# Altium project Tigresse_experience.PrjPcb
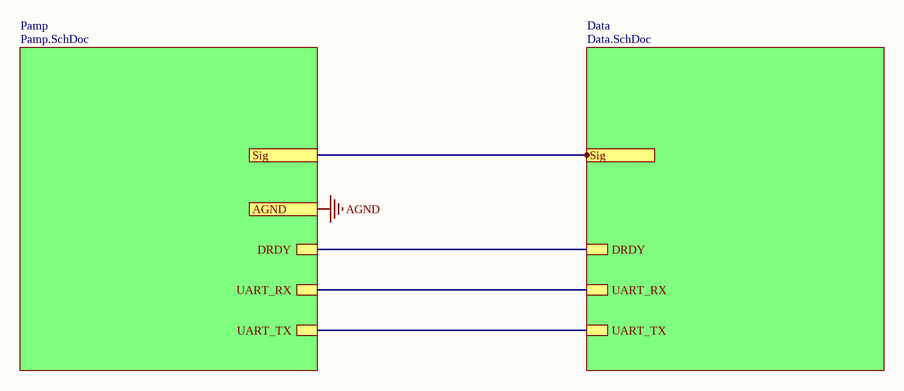
[diagram p0: schumann_exp.SchDoc]
3 sheets, 47 parts. Net scope: hierarchical (ports join the sheet entries above them; power ports are global).
Board file: pcb_tigresse_experiment.PcbDoc
Sheets:
  schumann_exp.SchDoc
    Pamp = Pamp.SchDoc
    Data = Data.SchDoc

## Sheet schumann_exp.SchDoc
size A3; SheetNumber: 1; SheetTotal: 3

### Sub-sheets
Data = Data.SchDoc: Sig, UART_TX, UART_RX, DRDY
Pamp = Pamp.SchDoc: UART_RX, UART_TX, DRDY

### Ports
AGND, Sig

### Nets
NetADC_14: sheet Pamp/DRDY, sheet Data/DRDY
NetADC_15: sheet Pamp/UART_RX, sheet Data/UART_RX
NetADC_16: sheet Pamp/UART_TX, sheet Data/UART_TX
(unnamed): port Sig, sheet Data/Sig

## Sheet Pamp.SchDoc
size A3; SheetNumber: 2; SheetTotal: 3
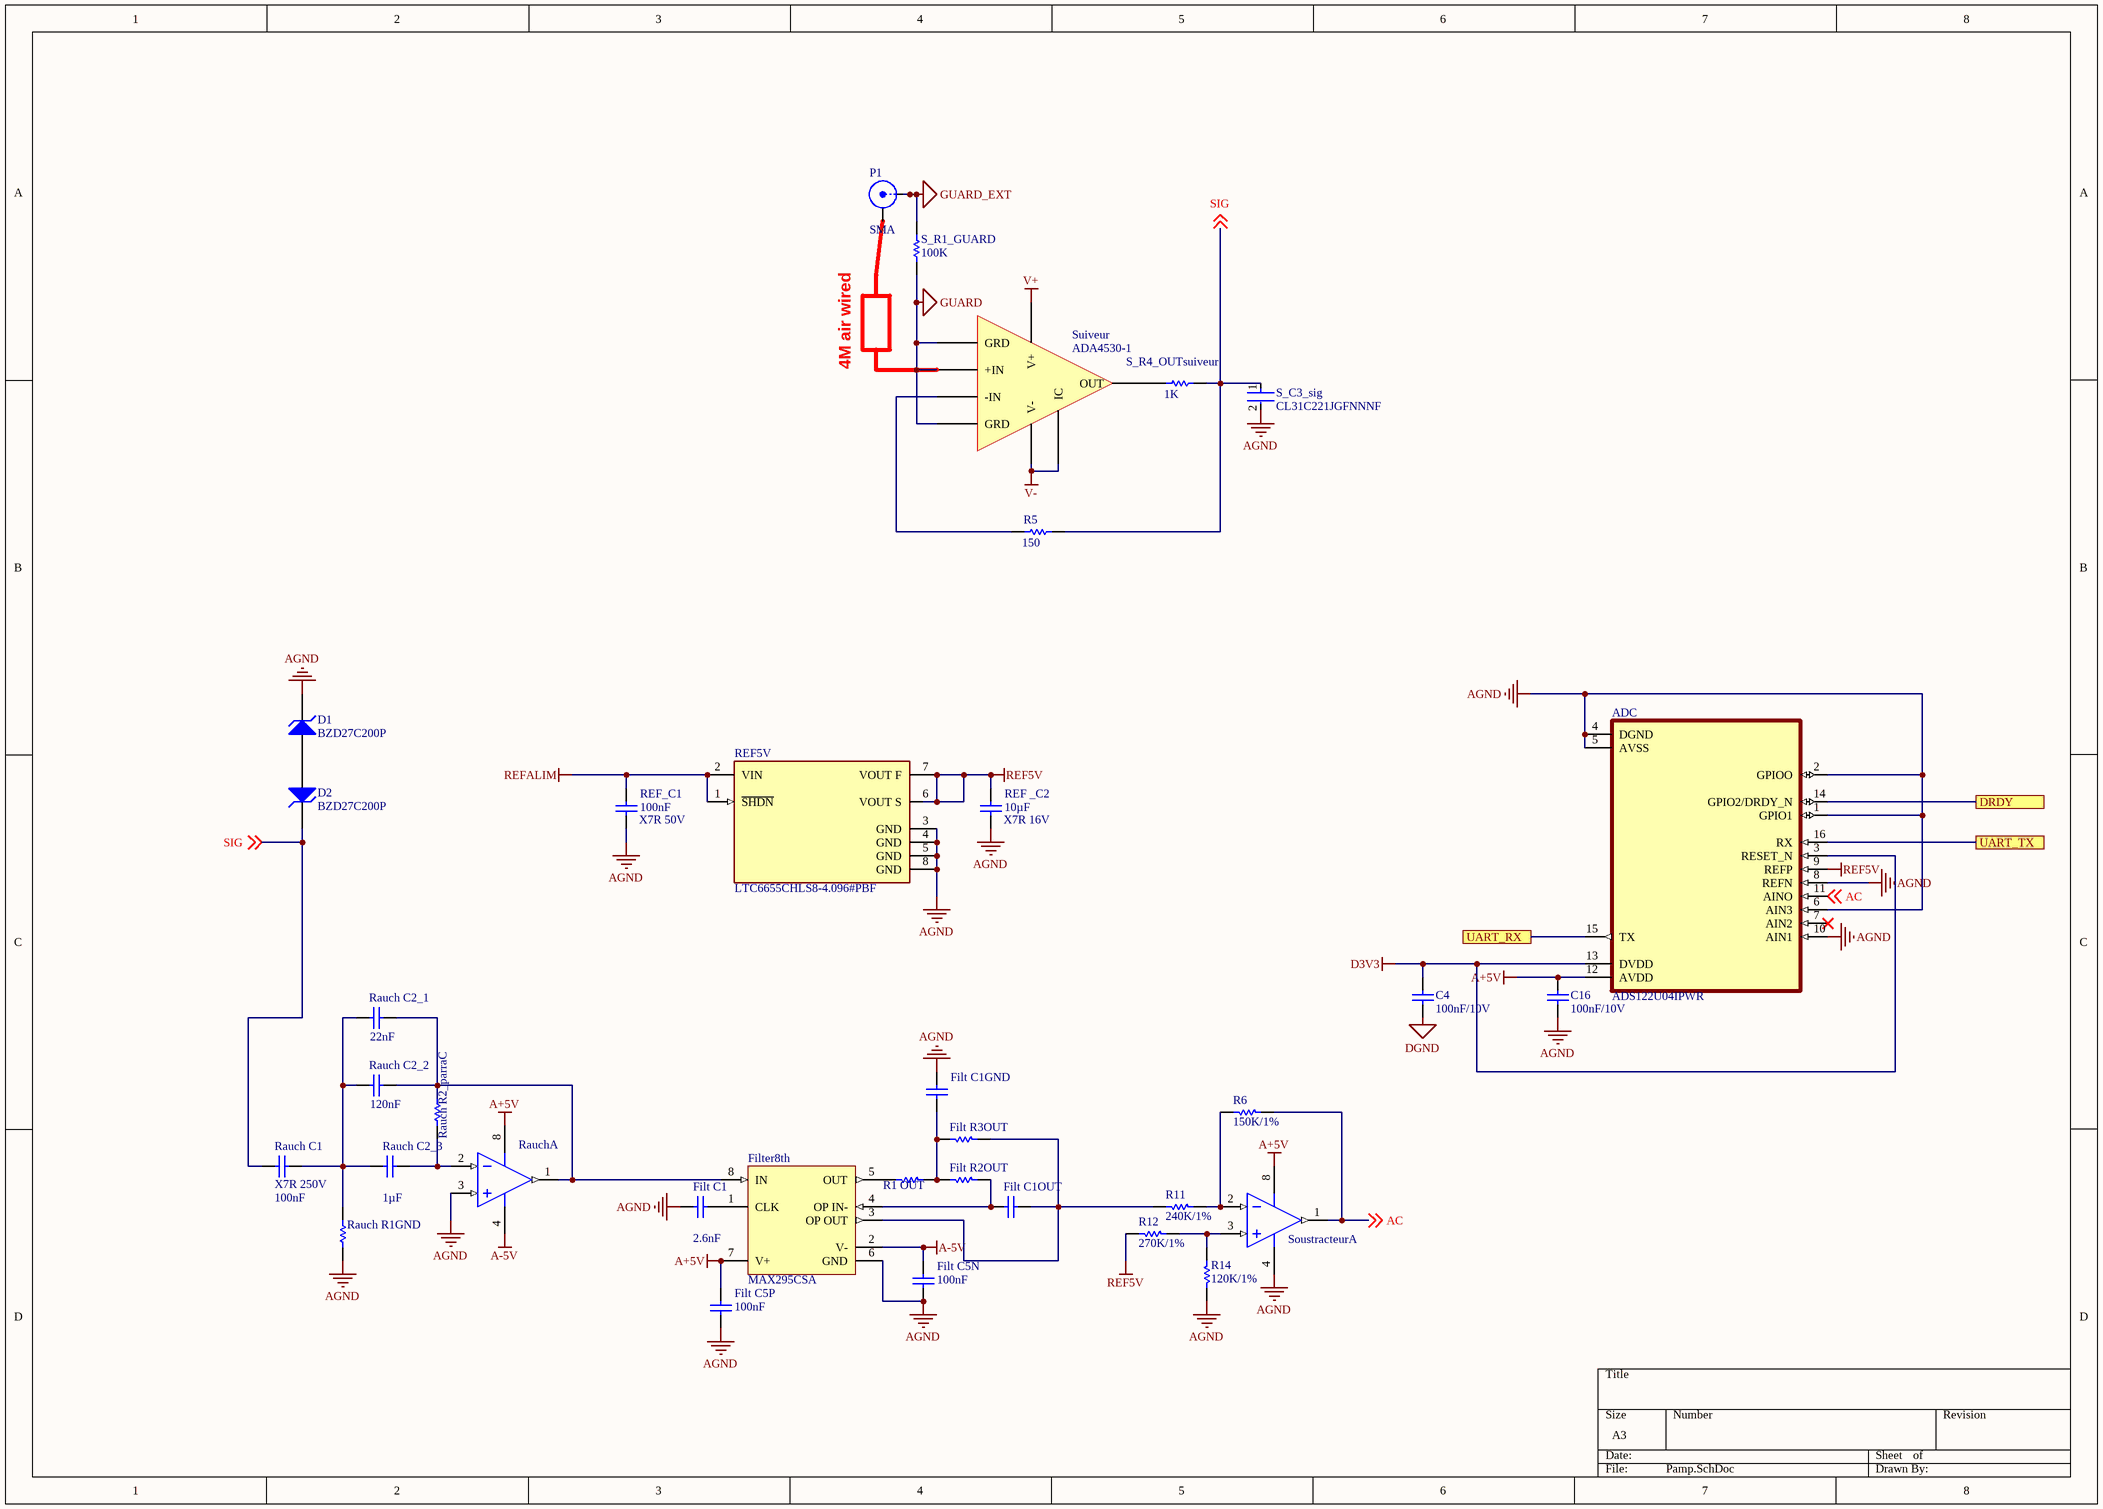
[diagram p1: Pamp.SchDoc]

### Parts
ADC  ADS122U04IPWR  [SOP65P640X120-16N]
C4  value 100nF/10V  [0805]  (hidden comment: C0805)
C16  value 100nF/10V  [0805]  (hidden comment: C0805)
D1  BZD27C200P  [DO219-AB]
D2  BZD27C200P  [DO219-AB]
Filt_C1  value 2.6nF  [1608[0603]]  (hidden comment: NPO/25V)
Filt_C1GND  NPO/25V  [1608[0603]]  (value not drawn)
Filt_C1OUT  NPO/25V  [1608[0603]]  (value not drawn)
Filt_C5N  value 100nF  [0603]  (hidden comment: X7R 50V)
Filt_C5P  value 100nF  [0603]  (hidden comment: X7R 50V)
Filt_R2OUT  100K/1%  [0603]  (value not drawn)
Filt_R3OUT  100K/1%  [0603]  (value not drawn)
Filter8th  MAX295CSA  [MAXM-S8-5_M]
P1  SMA  [SMB_V-RJ45]
R1_OUT  100K/1%  [0603]  (value not drawn)
R5  value 150  [0603]  (hidden comment: Res CMS)
R6  value 150K/1%  [0603]
R11  value 240K/1%  [0603]
R12  value 270K/1%  [0603]
R14  value 120K/1%  [0603]
Rauch  AD8642ARMZ  [ADI-RM-8_M]  (value not drawn)  (part A of 2)
Rauch_C1  X7R 250V  value 100nF  [1206]
Rauch_C2_1  value 22nF  [0603]  (hidden comment: X7R 16V)
Rauch_C2_2  value 120nF  [0603]  (hidden comment: X7R 25V)
Rauch_C2_3  value 1µF  [1206]  (hidden comment: X7R 250V)
Rauch_R1GND  RC0805FR-07100KL  [RESC2013X60X35ML10T20]  (value not drawn)
Rauch_R2_parraC  ERJ-6ENF2003V  [RESC2013X70X40LL20T20]  (value not drawn)
REF5V  LTC6655CHLS8-4.096#PBF  [FP-LS8-8-05-08-1852-MFG]
REF__C2  X7R 16V  value 10µF  [1206]
REF_C1  X7R 50V  value 100nF  [0603]
S_C3_sig  CL31C221JGFNNNF  [FP-CL31-IPC_C]
S_R1_GUARD  value 100K  [0603]  (hidden comment: Res CMS)
S_R4_OUTsuiveur  value 1K  [0603]  (hidden comment: Res CMS)
Soustracteur  AD8642ARMZ  [ADI-RM-8_M]  (value not drawn)  (part A of 2)
Suiveur  ADA4530-1  [SOIC127P600X175-8N]

### Ports
DRDY, UART_RX, UART_TX

### Nets
A+5V: ADC.12(AVDD) C16.1 Filt_C5P.2 Filter8th.7(V+) Rauch.8(+V) Soustracteur.8(+V)
A-5V: Filt_C5N.2 Filter8th.2(V-) Rauch.4(-V)
AGND: ADC.1(GPIO1) ADC.2(GPIOO) ADC.4(DGND) ADC.5(AVSS) ADC.6(AIN3) ADC.8(REFN) ADC.10(AIN1) C16.2 D1.2(K) Filt_C1.2 Filt_C1GND.1 Filt_C5N.1 Filt_C5P.1 Filter8th.6(GND) R14.2 Rauch.3(+IN_A) Rauch_R1GND.1 REF5V.3(GND) REF5V.4(GND) REF5V.5(GND) REF5V.8(GND) REF__C2.1 REF_C1.1 S_C3_sig.2 Soustracteur.4(-V)
D3V3: ADC.3(RESET_N) ADC.13(DVDD) C4.2
DGND: C4.1
GUARD: S_R1_GUARD.1 Suiveur.1(+IN) Suiveur.2(GRD) Suiveur.7(GRD)
GUARD_EXT: P1.1(X) S_R1_GUARD.2
REF5V: ADC.9(REFP) R12.2 REF5V.6(VOUT_S) REF5V.7(VOUT_F) REF__C2.2
REFALIM: REF5V.1(~{SHDN}) REF5V.2(VIN) REF_C1.2
V+: Suiveur.5(V+)
V-: Suiveur.3(IC) Suiveur.4(V-)
AC: ADC.11(AINO) R6.2 Soustracteur.1(OUT_A) ; off-sheet AC
SIG: D2.2(K) R5.2 Rauch_C1.2 S_C3_sig.1 S_R4_OUTsuiveur.2 ; off-sheet SIG
NetADC_14: ADC.14(GPIO2/DRDY_N) ; port DRDY
NetADC_15: ADC.15(TX) ; port UART_RX
NetADC_16: ADC.16(RX) ; port UART_TX
NetD1_1: D1.1(A) D2.1(A)
NetFilt_C1_1: Filt_C1.1 Filter8th.1(CLK)
NetFilt_C1GND_2: Filt_C1GND.2 Filt_R2OUT.2 Filt_R3OUT.2 R1_OUT.2
NetFilt_C1OUT_1: Filt_C1OUT.1 Filt_R2OUT.1 Filter8th.4(OP_IN-)
NetFilt_C1OUT_2: Filt_C1OUT.2 Filt_R3OUT.1 Filter8th.3(OP_OUT) R11.2
NetFilter8th_5: Filter8th.5(OUT) R1_OUT.1
NetFilter8th_8: Filter8th.8(IN) Rauch.1(OUT_A) Rauch_C2_1.1 Rauch_C2_2.1 Rauch_R2_parraC.2
NetR5_1: R5.1 Suiveur.8(-IN)
NetR6_1: R6.1 R11.1 Soustracteur.2(-IN_A)
NetR12_1: R12.1 R14.1 Soustracteur.3(+IN_A)
NetRauch_2: Rauch.2(-IN_A) Rauch_C2_3.1 Rauch_R2_parraC.1
NetRauch_C1_1: Rauch_C1.1 Rauch_C2_1.2 Rauch_C2_2.2 Rauch_C2_3.2 Rauch_R1GND.2
NetS_R4_OUTsuiveur_1: S_R4_OUTsuiveur.1 Suiveur.6(OUT)

Not connected (* = marked no-connect by the designer): ADC 7(AIN2)*; P1 2(Y)

### Notes on the sheet
- 4M air wired

### Library data of the parts
C4 C16 = C0805: Ceramic Chip Capacitor - Standard; Note: Footprint corresponds to dimensions for bulk cassette packaging. This case size has tightened tolerances.; Published: 17-Jul-2002; LatestRevisionDate: 19-Mar-2004; LatestRevisionNote: Silkscreen size reduced.; DatasheetDocument: Mar-2001; PackageDocument: Mar-2001; PackageReference: 0805; Publisher: Altium Limited; Code_JEITA: 0805; Code_IPC: 2012[0805]; ComponentLink1Description: Manufacturer Link; ComponentLink1URL: http://www.kemet.com/; ComponentLink2Description: Datasheet; ComponentLink2URL: http://www.kemet.com/kemet/web/homepage/kechome.nsf/vapubfilesname/F3102TA.pdf/$file/F3102TA.pdf
D1 D2 = D Zener: Zener Diode; Published: 8-Jun-2000; LatestRevisionDate: 17-Jul-2002; LatestRevisionNote: Re-released for DXP Platform.; PackageReference: DIODE-0.7; Publisher: Altium Limited; PackageDescription: Diode, Thru-Hole; 2 Leads; 0.7 in Pin Spacing
Filt_C1 Filt_C1GND Filt_C1OUT = Cap Semi: Capacitor (Semiconductor SIM Model); Published: 8-Jun-2000; LatestRevisionDate: 29-May-2009; LatestRevisionNote: IPC-7351 Footprint Added.; PackageReference: C1206; Publisher: Altium Limited; PackageDescription: Chip Capacitor
Filt_C5N Filt_C5P Rauch_C1 Rauch_C2_1-Rauch_C2_3 REF__C2 REF_C1 = Cap CMS: Capacitor (Semiconductor SIM Model); Published: 8-Jun-2000; LatestRevisionDate: 29-May-2009; LatestRevisionNote: IPC-7351 Footprint Added.; PackageReference: C1206; Publisher: Altium Limited; PackageDescription: Chip Capacitor
Filt_R2OUT Filt_R3OUT R1_OUT R5 R6 R11 R12 R14 S_R1_GUARD S_R4_OUTsuiveur = Res CMS: Resistor; Published: 8-Jun-2000; LatestRevisionDate: 17-Jul-2002; LatestRevisionNote: Re-released for DXP Platform.; PackageReference: AXIAL-0.3; Publisher: Altium Limited; PackageDescription: Axial Device, Thru-Hole; 2 Leads; 0.3 in Pin Spacing
  R1_OUT: Value: 100K/1%
Filter8th = CMP-0026-00196-2: 8th-Order Switched Capacitor Lowpass Filter, Butterworth, Clock Tunable, 0 to 70 degC, 8-Pin SOIC (S8-5); Generic Part Number: MAX295; Filter Sections: 1; Order Per Filter Section: 8; ComponentLink3URL: http://pdfserv.maximintegrated.com/package_dwgs/21-0041.PDF; Filter Characteristic: Butterworth; DatasheetVersion: Rev. 5; Code_JEDEC: MS012; ComponentLink3Description: Package Specification; ComponentLink2URL: http://datasheets.maximintegrated.com/en/ds/MAX291-MAX296.pdf; ComponentLink1URL: http://www.maximintegrated.com/; Mounting Technology: Surface Mount; PartNumber: MAX295CSA; PackageReference: S8-5; Filter Class: Switched Cap; PackageDescription: 8-Pin Small-Outline IC, Narrow (0.15in) (S8-5), Body 4.90 x 3.90 mm, Pitch 1.27 mm; Filter Type: Lowpass; ComponentLink1Description: Manufacturer URL; PackageVersion: Rev. D, 10/2012; Program Method: Clock; ComponentLink2Description: Datasheet
P1 = SMB: SMA 90deg ConnectorR125680000; LatestRevisionDate: 17-Jul-2002; LatestRevisionNote: Re-released for DXP Platform.; Publisher: Altium Limited
Rauch Soustracteur = CMP-0384-01629-1: Double Channel Very Low Input Bias Current Operational Amplifier, 3.5 MHz BW, 3 V/us SR, Industrial, 8-pin SOP (RM-8), Tube; Manufacturer: Analog Devices; Generic Part Number: AD8642; Input Offset Voltage: 50uV; Small Signal Bandwidth: 3.5MHz; Iq/Amp: 290uA; Input Bias Current: 250fA; V Span Min: 5V; V Span Max: 26V; Slew Rate: 3V/us; Amplifiers Per Package: 2; PackageReference: RM-8; ComponentLink1URL: http://www.analog.com/en/index.html; ComponentLink2URL: http://www.analog.com/static/imported-files/data_sheets/AD8641_8642_8643.pdf; ComponentLink3URL: http://www.analog.com/static/imported-files/packages/PKG_PDF/MSOP%28RM%29/RM_8.pdf; PackageDescription: 8-Pin Mini Small Outline Package, Body 3 x 3 mm, Pitch 0.65 mm; DatasheetVersion: Rev. E; Mounting Technology: Surface Mount; PartNumber: AD8642ARMZ; ComponentLink3Description: Package Specification; Code_JEDEC: MO-187-AA; ComponentLink1Description: Manufacturer URL; ComponentLink2Description: Datasheet
Rauch_R1GND = CMP-2100-03668-1: Chip Resistor, 100 KOhm, +/- 1%, 0.125 W, -55 to 155 degC, 0805 (2012 Metric), RoHS, Tape and Reel; Manufacturer: Yageo; Max Power Dissipation: 125mW; Voltage Rating: 150V; Temperature Coefficient: 100ppm/degreesC; Manufacturer URL: http://www.yageo.com/; Min Operating Temperature: -55degC; Lead Pitch: 0.4mm; Composition: ThickFilm; Case Code (Metric): 2012; Military Standard: Not; Package Description: 2-Pin Surface Mounted Device, Body 2 x 1.25 mm; REACH SVHC: Unknown; RoHSCompliant: true; Depth: 1.25mm; Number of Pins: 2; Lead Free: LeadFree; Resistance: 100KOhm; Datasheet URL: http://www.yageo.com/NewPortal/yageodocoutput?fileName=/pdf/R-Chip/PYu-RC_Group_51_RoHS_L_5.pdf; Max Operating Temperature: 155degC; Case/Package: 0805; Package Quantity: 1; Case Code (Imperial): 0805; Power Rating: 125mW; Width: 0.049inch; Package Reference: 0805; Height: 0.024inch; Termination: SMD/SMT; Tolerance: 1%; Datasheet Version: Rev. 5, 10/2016; Length: 2mm; Voltage Rating (DC): 150V; Number of Terminations: 2; Packaging: TapeandReel
Rauch_R2_parraC = CMP-2001-00028-1: Manufacturer: Panasonic; Part Number: ERJ-6ENF2003V
REF5V = CMP-09137-000020-1: IC VREF SERIES 0.05% 8CLCC; Min Output Voltage: 4.096V; Temperature Coefficient: 5ppm/°C; Operating Supply Current: 7.5mA; Output Type: Fixed; Output Current: 5mA; Min Operating Temperature: -40°C; REACH SVHC: No SVHC; RoHS Compliant: Yes; Tolerance: 0.05%; Reference Type: Series; Mount: Surface Mount; Case/Package: CLCC; Packaging: Tray; Reference Voltage: 4.096V; Max Operating Temperature: 125°C; Number of Pins: 8; Package Quantity: 576
S_C3_sig = CMP-13271-001211-1: Cap Ceramic 220pF 500V C0G ±5% SMD 1206 +125°C Embossed T/R; Tolerance: 5%; Voltage Rating (DC): 500V; Depth: 1.6mm; Capacitance: 220pF; Max Operating Temperature: 125°C; Width: 0.063inch; Radiation Hardening: No; Thickness: 0.055inch; Packaging: Tape and Reel; Height: 1.25mm; Case/Package: 1206; Package Quantity: 10000; Dielectric: C0G; Mount: Surface Mount; Voltage Rating: 500V; Min Operating Temperature: -55°C; Length: 3.2mm
ADC = ADS122U04IPWR: Package: None; Price: None; Value: *; MP: ADS122U04IPWR; Availability: Unavailable

## Sheet Data.SchDoc
size A3; SheetNumber: 3; SheetTotal: 3
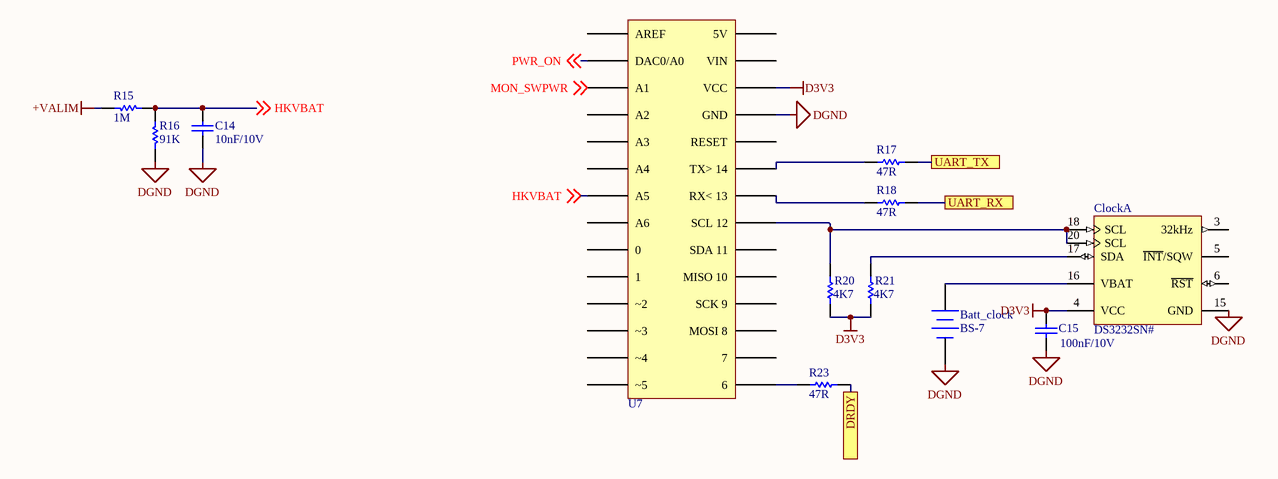
[diagram p2: Data.SchDoc]

### Parts
Batt_clock  BS-7  [BS-7-ND]
C14  value 10nF/10V  [0603]  (hidden comment: C0603)
C15  value 100nF/10V  [0805]  (hidden comment: C0805)
Clock  DS3232SN#  [W20#H2_N]  (part A of 2)
R15  value 1M  [0603]  (hidden comment: Res CMS)
R16  value 91K  [0603]  (hidden comment: Res CMS)
R17  value 47R  [0603]  (hidden comment: Res CMS)
R18  value 47R  [0603]  (hidden comment: Res CMS)
R20  value 4K7  [0603]  (hidden comment: Res CMS)
R21  value 4K7  [0603]  (hidden comment: Res CMS)
R23  value 47R  [0603]  (hidden comment: Res CMS)
U7  Arduino MKRZero  [Arduino MKRZero]  (value not drawn)

### Ports
DRDY, UART_RX, UART_TX

### Nets
+VALIM: R15.2
D3V3: C15.1 Clock.4(VCC) R20.1 R21.1 U7.26(VCC)
DGND: Batt_clock.2(-) C14.1 C15.2 Clock.15(GND) R16.2 U7.25(GND)
HKVBAT: C14.2 R15.1 R16.1 U7.7(A5) ; off-sheet HKVBAT
MON_SWPWR: U7.3(A1) ; off-sheet MON_SWPWR
PWR_ON: U7.2(DAC0/A0) ; off-sheet PWR_ON
NetADC_14: R23.1 ; port DRDY
NetADC_15: R18.1 ; port UART_RX
NetADC_16: R17.1 ; port UART_TX
NetBatt_clock_1: Batt_clock.1(+) Clock.16(VBAT)
NetClock_17: Clock.17(SDA) R21.2
NetClock_18: Clock.18(SCL) Clock.20(SCL) R20.2 U7.21(SCL_12)
NetR17_2: R17.2 U7.23(TX>_14)
NetR18_2: R18.2 U7.22(RX<_13)
NetR23_2: R23.2 U7.15(6)

Not connected (* = marked no-connect by the designer): Clock 3(32kHz) 5(~{INT}/SQW) 6(~{RST}); U7 1(AREF) 4(A2) 5(A3) 6(A4) 8(A6) 9(0) 10(1) 11(~2) 12(~3) 13(~4) 14(~5) 16(7) 17(MOSI_8) 18(SCK_9) 19(MISO_10) 20(SDA_11) 24(RESET) 27(VIN) 28(5V)

### Library data of the parts
Batt_clock = BS-7: BS-7 CR2032 battery holder; Published: 24-Mar-1999; LatestRevisionDate: 17-Jul-2002; LatestRevisionNote: Re-released for DXP Platform.; PackageReference: BAT-2; Publisher: Altium Limited; PackageDescription: Battery; 2 Leads
C14 = C0603: Ceramic Chip Capacitor - Standard; Note: Footprint corresponds to dimensions for bulk cassette packaging. This case size has tightened tolerances.; Published: 17-Jul-2002; LatestRevisionDate: 19-Mar-2004; LatestRevisionNote: Silkscreen size reduced.; DatasheetDocument: Mar-2001; PackageDocument: Mar-2001; PackageReference: 0603; Publisher: Altium Limited; Code_JEITA: 0603; Code_IPC: 1608 [0603]; ComponentLink1Description: Manufacturer Link; ComponentLink1URL: http://www.kemet.com/; ComponentLink2Description: Datasheet; ComponentLink2URL: http://www.kemet.com/kemet/web/homepage/kechome.nsf/vapubfilesname/F3102TA.pdf/$file/F3102TA.pdf
C15 = C0805: as C4 on sheet Pamp; Published: 17-Jul-2002; LatestRevisionDate: 19-Mar-2004; LatestRevisionNote: Silkscreen size reduced.; DatasheetDocument: Mar-2001; PackageDocument: Mar-2001; PackageReference: 0805; Publisher: Altium Limited; Code_JEITA: 0805; Code_IPC: 2012[0805]; ComponentLink1Description: Manufacturer Link; ComponentLink1URL: http://www.kemet.com/; ComponentLink2Description: Datasheet; ComponentLink2URL: http://www.kemet.com/kemet/web/homepage/kechome.nsf/vapubfilesname/F3102TA.pdf/$file/F3102TA.pdf
Clock = CMP-0254-00381-1: Extremely Accurate I2C-Integrated Real-Time Clock/TCXO/Crystal and SRAM, 20-Pin SO, -40 to 85 degC, RoHS Qualified; PackageDescription: 20-Pin Small-Outline IC, Wide (0.3in), 1.27 mm Pitch, SOIC (W), RoHS Qualified; Code_JEDEC: MS-013-AC; ComponentLink2URL: http://datasheets.maxim-ic.com/en/ds/DS3232.pdf; ComponentLink1URL: http://www.maxim-ic.com; PackageVersion: revD, 2010; Code_IPC: SOIC127P1030-20; ComponentLink3URL: http://pdfserv.maxim-ic.com/package_dwgs/21-0042.PDF; ComponentLink1Description: Manufacturer URL; PackageReference: W20#H2; ComponentLink2Description: Datasheet; ComponentLink3Description: Package Specification; DatasheetVersion: Rev 5, Jul-2010
R15-R18 R20 R21 R23 = Res CMS: Resistor; Published: 8-Jun-2000; LatestRevisionDate: 17-Jul-2002; LatestRevisionNote: Re-released for DXP Platform.; PackageReference: AXIAL-0.3; Publisher: Altium Limited; PackageDescription: Axial Device, Thru-Hole; 2 Leads; 0.3 in Pin Spacing

## Nets that join several sheets
D3V3: Pamp (ADC.3 ADC.13 C4.2), Data (5 pins)
DGND: Pamp (C4.1), Data (6 pins)
NetADC_14: Pamp (ADC.14), Data (R23.1)
NetADC_15: Pamp (ADC.15), Data (R18.1)
NetADC_16: Pamp (ADC.16), Data (R17.1)